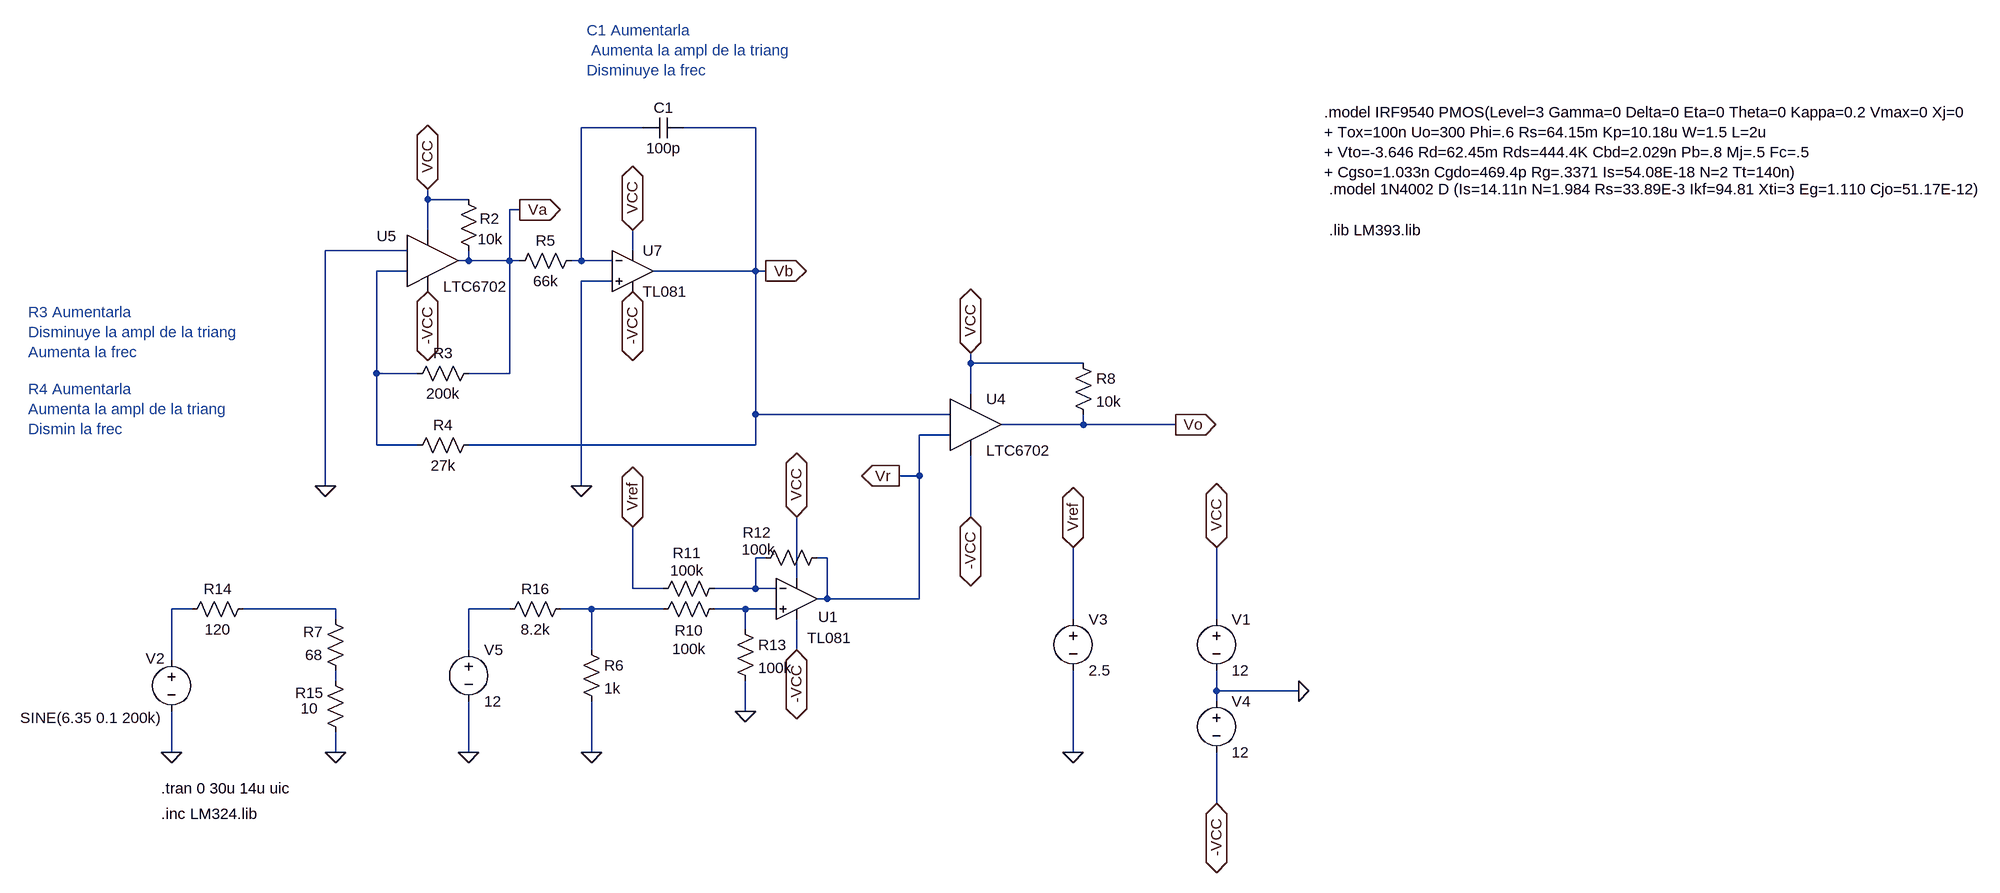
[diagram p0: schematic PWM.asc]
* PWM.asc
R5 N001 Va 66k
V1 VCC 0 12
R3 Va N002 200k
R4 Vb N002 27k
V2 N004 0 SINE(6.35 0.1 200k)
C1 Vb N001 100p
* U7: TL081 (symbol TL081 not available, pins judged from their places): In+=0 In-=N001 V+=VCC V-=-VCC OUT=Vb
R7 N009 N005 68
* U1: TL081 (symbol TL081 not available, pins judged from their places): In+=N008 In-=N003 V+=VCC V-=-VCC OUT=Vr
V3 Vref 0 2.5
V4 0 -VCC 12
R2 VCC Va 10k
R8 VCC Vo 10k
R10 N008 N007 100k
R11 N003 Vref 100k
R12 Vr N003 100k
R13 N008 0 100k
R14 N005 N004 120
R15 N009 0 10
R6 N007 0 1k
R16 N007 N006 8.2k
V5 N006 0 12
XU4 Vr Vb VCC -VCC Vo LTC6702
XU5 N002 0 VCC -VCC Va LTC6702
.tran 0 30u 14u uic
.model IRF9540 PMOS(Level=3 Gamma=0 Delta=0 Eta=0 Theta=0 Kappa=0.2 Vmax=0 Xj=0
+ Tox=100n Uo=300 Phi=.6 Rs=64.15m Kp=10.18u W=1.5 L=2u
+ Vto=-3.646 Rd=62.45m Rds=444.4K Cbd=2.029n Pb=.8 Mj=.5 Fc=.5
+ Cgso=1.033n Cgdo=469.4p Rg=.3371 Is=54.08E-18 N=2 Tt=140n)
.model 1N4002 D (Is=14.11n N=1.984 Rs=33.89E-3 Ikf=94.81 Xti=3 Eg=1.110 Cjo=51.17E-12)
.inc LM324.lib
* R4 Aumentarla
* Aumenta la ampl de la triang
* Dismin la frec
* R3 Aumentarla
* Disminuye la ampl de la triang
* Aumenta la frec
* C1 Aumentarla
*  Aumenta la ampl de la triang
* Disminuye la frec
.lib LM393.lib
.lib LTC3.lib
.backanno
.end

* Results of the author's LTspice run, read from the files saved beside the schematic
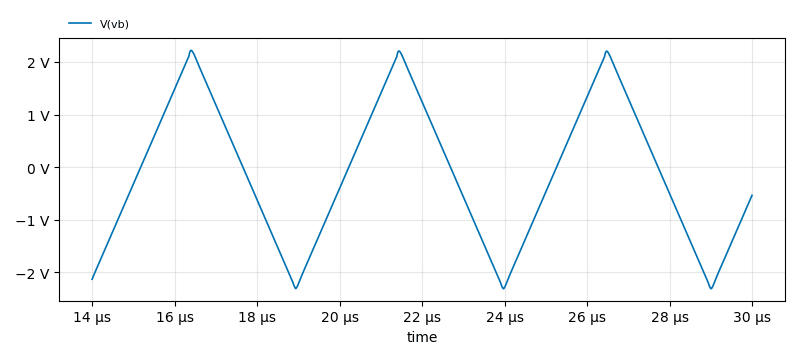
[diagram p1: Transient Analysis of PWM.asc, plotted from the saved traces]
* Transient Analysis, 1 run:
*   V(vb): min -2.316 V, max 2.22 V, average -119.4 mV, rms 1.391 V, last -538.4 mV